# Altium schematic sheet FPGA_I_J.SchDoc: FIT_PM12 board
size 420 x 297 mm; CheckedBy: G.Kasprowicz; Author: INR Moscow; CompanyName: WUT ISE; DrawnBy: M.Podgórski; Organization: WUT ISE; Address1: PW ISE; Address2: Nowowiejska 15/19 00-665 Warsaw; Address3: gkasprow@gmail.com; DocumentNumber: 32; Revision: 2; SheetNumber: 32; SheetTotal: 34; ModifiedBy: -; CheckedDate: -; Title2: FPGA JTAG MGTs; DivGrp: WUT ISE; Designer: INR RAS; ModifiedDate: -; ProjectName: Sensor Box
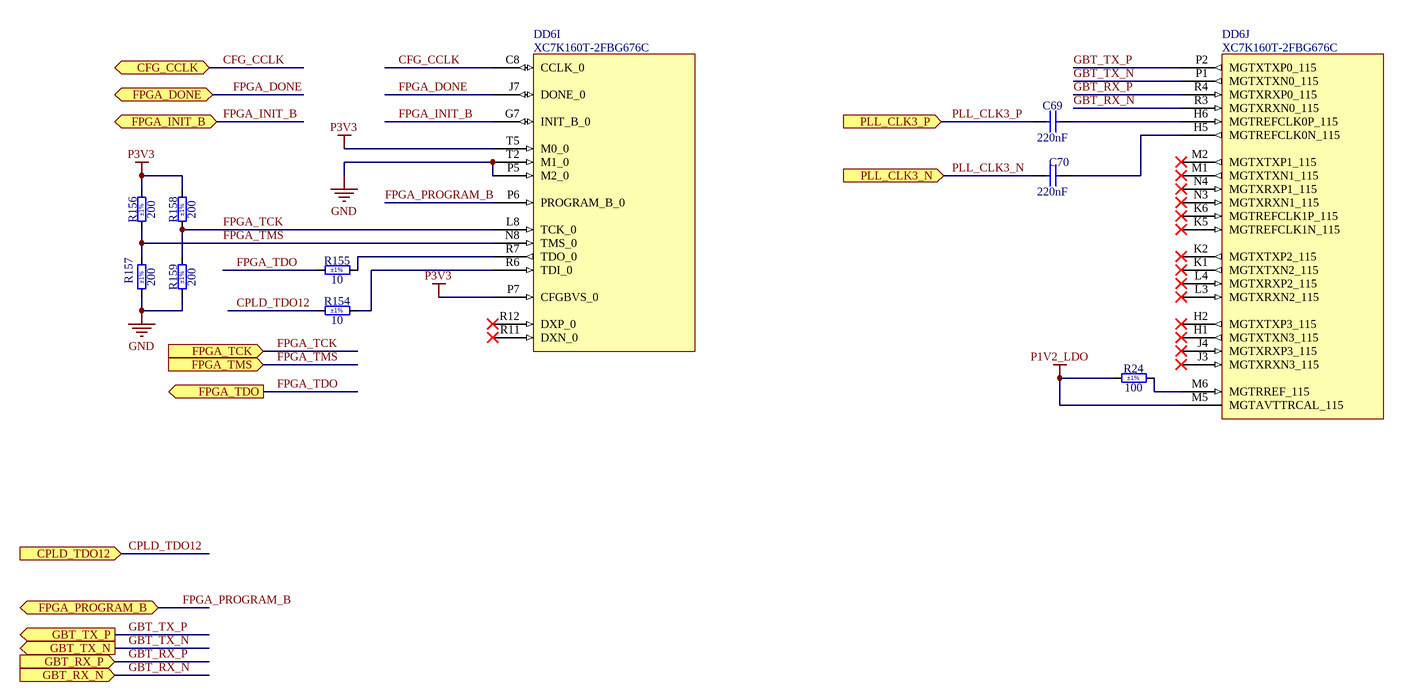
[diagram p0: FPGA_I_J.SchDoc]

## Parts
C69  220nF  [CAPC1608X87N]
C70  220nF  [CAPC1608X87N]
DD6  XC7K160T-2FBG676C  [BGA676C100P26X26_2700X2700X254]  (parts I,J of 15)
R24  100  Tolerance: ±1%  [RESC1608X55N]
R154  10  Tolerance: ±1%  [RESC2012X70N]
R155  10  Tolerance: ±1%  [RESC2012X70N]
R156  200  Tolerance: ±1%  [RESC2012X60N]
R157  200  Tolerance: ±1%  [RESC2012X60N]
R158  200  Tolerance: ±1%  [RESC2012X60N]
R159  200  Tolerance: ±1%  [RESC2012X60N]

## Ports
CFG_CCLK (bidir), CPLD_TDO12 (in), FPGA_DONE (bidir), FPGA_INIT_B (bidir), FPGA_PROGRAM_B (bidir), FPGA_TCK (in), FPGA_TDO (out), FPGA_TMS (in), GBT_RX_N (in), GBT_RX_P (in), GBT_TX_N (out), GBT_TX_P (out), PLL_CLK3_N (in), PLL_CLK3_P (in)

## Nets
GND: DD6.P5(M2_0) DD6.T2(M1_0) R157.1 R159.1
P1V2_LDO: DD6.M5(MGTAVTTRCAL_115) R24.1
P3V3: DD6.P7(CFGBVS_0) DD6.T5(M0_0) R156.2 R158.2
CFG_CCLK: DD6.C8(CCLK_0) ; port CFG_CCLK
CPLD_TDO12: R154.1 ; port CPLD_TDO12
FPGA_DONE: DD6.J7(DONE_0) ; port FPGA_DONE
FPGA_INIT_B: DD6.G7(INIT_B_0) ; port FPGA_INIT_B
FPGA_PROGRAM_B: DD6.P6(PROGRAM_B_0) ; port FPGA_PROGRAM_B
FPGA_TCK: DD6.L8(TCK_0) R158.1 R159.2 ; port FPGA_TCK
FPGA_TDO: R155.1 ; port FPGA_TDO
FPGA_TMS: DD6.N8(TMS_0) R156.1 R157.2 ; port FPGA_TMS
GBT_RX_N: DD6.R3(MGTXRXN0_115) ; port GBT_RX_N
GBT_RX_P: DD6.R4(MGTXRXP0_115) ; port GBT_RX_P
GBT_TX_N: DD6.P1(MGTXTXN0_115) ; port GBT_TX_N
GBT_TX_P: DD6.P2(MGTXTXP0_115) ; port GBT_TX_P
PLL_CLK3_N: C70.1 ; port PLL_CLK3_N
PLL_CLK3_P: C69.1 ; port PLL_CLK3_P
NetC69_2: C69.2 DD6.H6(MGTREFCLK0P_115)
NetC70_2: C70.2 DD6.H5(MGTREFCLK0N_115)
NetDD6_M6: DD6.M6(MGTRREF_115) R24.2
NetDD6_R6: DD6.R6(TDI_0) R154.2
NetDD6_R7: DD6.R7(TDO_0) R155.2

Not connected (* = marked no-connect by the designer): DD6 H1(MGTXTXN3_115)* H2(MGTXTXP3_115)* J3(MGTXRXN3_115)* J4(MGTXRXP3_115)* K1(MGTXTXN2_115)* K2(MGTXTXP2_115)* K5(MGTREFCLK1N_115)* K6(MGTREFCLK1P_115)* L3(MGTXRXN2_115)* L4(MGTXRXP2_115)* M1(MGTXTXN1_115)* M2(MGTXTXP1_115)* N3(MGTXRXN1_115)* N4(MGTXRXP1_115)* R11(DXN_0)* R12(DXP_0)*

## Notes on the sheet
- Project/Equipment
- Document
- Designer
- Drawn by
- Check.by
- Copyright WUT ISE 2024.
  This documentation describes Open Hardware and is licensed under the CERN OHL v.2. You may redistribute and modify this documentation under the terms of the CERN OHL v.2. (http://ohwr.org/CERNOHL). This documentation is distributed WITHOUT ANY EXPRESS OR IMPLIED WARRANTY, INCLUDING OF MERCHANTABILITY, SATISFACTORY QUALITY AND FITNESS FOR A PARTICULAR PURPOSE. Please see the CERN OHL v.2 for applicable conditions.
- Contact
- File
- Last Mod.
- Print Date
- Sheet
- Size
- A3
- of
- Rev

## Library data of the parts
C69 C70 = CC0603_220NF_25V_10%_X7R: Non-polarised capacitor; Part Description: SMD Multilayer Chip Ceramic Capacitor; Manufacturer: GENERIC; Manufacturer1 Part Number: C0603C224K3RACTU; Voltage: 25V; TC: X7R; Tolerance: ±10%; Part Number: CC0603_220NF_25V_10%_X7R; Component Kind: Standard; Component Type: Standard; Pin Count: 2; Value: 220nF; Status: Preferred; Manufacturer Part Number: CC0603_220NF_25V_10%_X7R; Case: 0603; Mounted: Yes; Socket: No; SMD: Yes; Sense: No; Manufacturer1 Example: KEMET; Manufacturer1 ComponentHeight: 0.87mm; HelpURL: \\cern.ch\dfs\Applications\Altium\Datasheets\CC0603_X7R_KEMET.pdf; Author: CERN DEM JLC; CreateDate: 29.10.2014; LatestRevisionDate: 29.10.2014
DD6 = XC7K160T-2FBG676C: KINTEX-7, FPGA, 676-Ball BGA, Pb-Free; Part Description: KINTEX-7 FPGA, 162240 Logic Cells, 400 User I/O, 8 GTXs, 676-Ball BGA, Speed Grade 2, Commercial Grade, Pb-Free; Manufacturer: XILINX; PressFit: No; Bonding: No; Part Number: XC7K160T-2FBG676C; Component Kind: Standard; Component Type: Standard; Device: XC7K160T-2FBG676C; PackageDescription: BGA, 1.00mm Pitch, Square; 676 Pin, 26 Columns X 26 Rows, Body 27.0mm X 27.0mm X 2.54mm H, IPC Medium Density; Manufacturer Part Number: XC7K160T-2FBG676C; Pin Count: 676; Case: BGA676; Mounted: Yes; Socket: No; SMD: Yes; Sense: No; ComponentHeight: 2.54mm; HelpURL: \\cern.ch\dfs\Applications\Altium\Datasheets\XC7K160T-xFBG676C.pdf; ComponentLink1URL: \\cern.ch\dfs\Applications\Altium\Datasheets\XC7K160T-xFBG676C_Package-Pinout.pdf; ComponentLink1Description: Package/Pinout; Author: CERN DEM BC; CreateDate: 06.02.2020; LatestRevisionDate: 06.02.2020
R24 = R0603_100R_1%_0.1W_100PPM: Resistor - 1%; Part Description: General Purpose Thick Film Chip Resistor; Manufacturer: GENERIC; Manufacturer1 Part Number: NRC06F4700TRF; Power: 0.1W; TC: ±100ppm/°C; PressFit: No; Part Number: R0603_100R_1%_0.1W_100PPM; Component Kind: Standard; Component Type: Standard; Pin Count: 2; Value: 100; Status: Preferred; Manufacturer Part Number: R0603_100R_1%_0.1W_100PPM; Case: 0603; Mounted: Yes; Sense: No; Socket: No; SMD: Yes; Manufacturer1 Example: NIC COMPONENT; Manufacturer1 ComponentHeight: 0.55mm; HelpURL: \\cern.ch\dfs\Applications\Altium\Datasheets\R0603_NIC_NRC.pdf; Author: CERN DEM JLC; CreateDate: 03.12.2007; LatestRevisionDate: 13.03.2008
R154 R155 = R0805_10R_1%_0.125W_100PPM_PANASONIC_ERJ: Resistor - 1%; Part Description: Low Resistance Thick Film Chip Resistor; Manufacturer Part Number: ERJ6ENF10R0V; Power: 0.125W; TC: ±100ppm/°C; PressFit: No; Part Number: R0805_10R_1%_0.125W_100PPM_PANASONIC_ERJ; Component Kind: Standard; Component Type: Standard; Pin Count: 2; Value: 10; Status: None; Manufacturer: PANASONIC; Case: 0805; Mounted: Yes; Sense: No; Socket: No; SMD: Yes; ComponentHeight: 0.7mm; HelpURL: \\cern.ch\dfs\Applications\Altium\Datasheets\R0805_PANASONIC_ERJ6EN.pdf; Author: CERN DEM HF; CreateDate: 07.06.2024; LatestRevisionDate: 07.06.2024
R156-R159 = R0805_200R_1%_0.125W_100PPM: Resistor - 1%; Part Description: General Purpose Thick Film Chip Resistor; Manufacturer: GENERIC; Manufacturer1 Part Number: NRC10F2000TRF; Power: 0.125W; TC: ±100ppm/°C; PressFit: No; Part Number: R0805_200R_1%_0.125W_100PPM; Component Kind: Standard; Component Type: Standard; Pin Count: 2; Value: 200; Status: Preferred; Manufacturer Part Number: R0805_200R_1%_0.125W_100PPM; Case: 0805; Mounted: Yes; Sense: No; Socket: No; SMD: Yes; Manufacturer1 Example: NIC COMPONENT; Manufacturer1 ComponentHeight: 0.6mm; HelpURL: \\cern.ch\dfs\Applications\Altium\Datasheets\R0805_NIC_NRC.pdf; Author: CERN DEM JLC; CreateDate: 03.12.2007; LatestRevisionDate: 13.03.2008